# EAGLE design leakio (EAGLE 9.6.2)
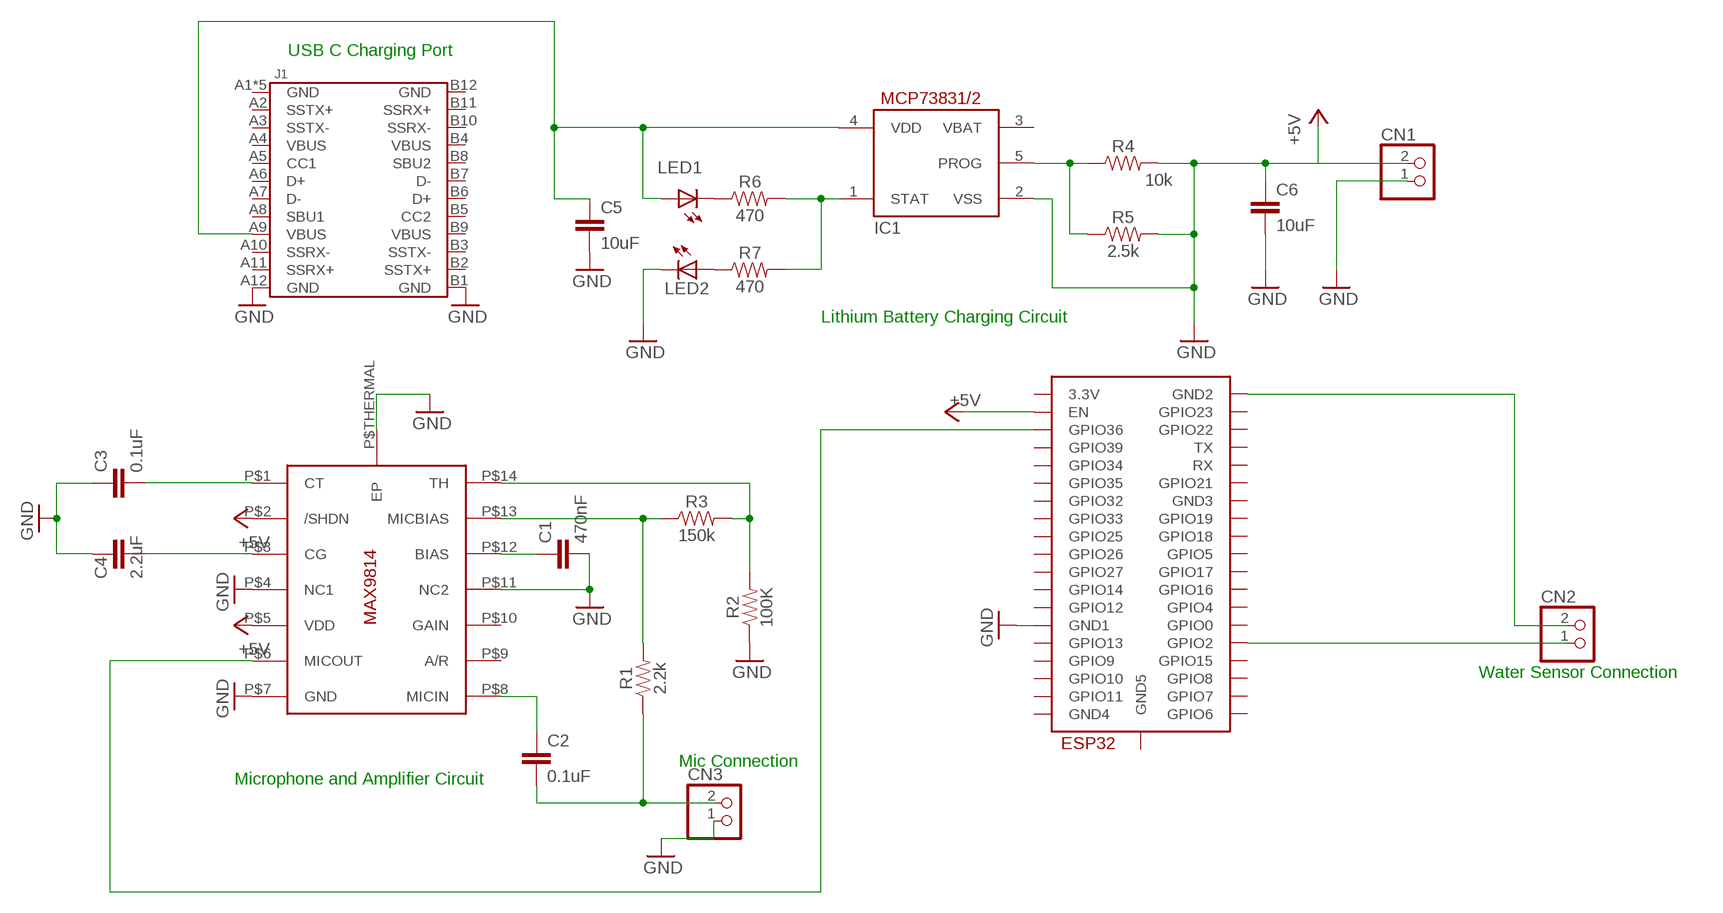
[diagram p0: schematic, sheet 1]

## Parts
C1  470nF  470NF-0402-16V-10%  [0402]
C2  0.1uF  0.1UF-0402-16V-10%  [0402]
C3  0.1uF  0.1UF-0402-16V-10%  [0402]
C4  2.2uF  2.2UF-0603-10V-20%  [0603]
C5  10uF  10UF-0603-6.3V-20%  [0603]
C6  10uF  10UF-0603-6.3V-20%  [0603]
CN1  JST_2PIN-SMT-RA  [JST-PH-2-SMT-RA]
CN2  JST_2PIN-SMT  [JST-PH-2-SMT]
CN3  JST_2PIN-SMT  [JST-PH-2-SMT]
IC1  MCP73831/OT  [SOT23-5L]
J1  USBC-PTH  [USB-C-PTH]
LED1  LED  [SMARTLED-TTW]
LED2  LED  [SMARTLED-TTW]
R1  2.2k  2.2KOHM-0603-1/10W-1%  [0603]
R2  100K  100KOHM-0402-1/16W-1%  [0402]
R3  150k  150KOHM-0603-1/10W-1%  [0603]
R4  10k  10KOHM-0603-1/10W-1%  [0603]
R5  2.5k  10KOHM-0603-1/10W-1%  [0603]
R6  470  10KOHM-0603-1/10W-1%  [0603]
R7  470  10KOHM-0603-1/10W-1%  [0603]
U$1  ESP32-WROOM  [ESP32-WROOM]
U$2  MAX9814TDFN14  [TDFN14_3X3MM]

## Nets
+5V: C6.1 CN1.2 IC1.2(VSS) R4.2 R5.2 U$1.EN U$2.P$2(/SHDN) U$2.P$5(VDD) ; supply symbol labelled GND
GND: C1.2 C3.1 C4.1 C5.2 C6.2 CN3.1 J1.A12(GND) J1.B1(GND) LED2.C@1(C) R2.1 U$1.GND1 U$2.P$4(NC1) U$2.P$7(GND) U$2.P$11(NC2) U$2.P$THERMAL(EP)
N$1: C3.2 U$2.P$1(CT)
N$2: C4.2 U$2.P$3(CG)
N$3: C5.1 IC1.4(VDD) J1.A9(VBUS) LED1.A@1(A)
N$4: U$1.SENSOR_VP(GPIO36) U$2.P$6(MICOUT)
N$5: C2.1 U$2.P$8(MICIN)
N$6: C2.2 CN3.2 R1.1
N$7: C1.1 U$2.P$12(BIAS)
N$8: LED2.A@1(A) R7.1
N$9: R1.2 R3.1 U$2.P$13(MICBIAS)
N$10: R2.2 R3.2 U$2.P$14(TH)
N$11: IC1.5(PROG) R4.1 R5.1
N$12: LED1.C@1(C) R6.1
N$13: CN2.1 U$1.IO2(GPIO2)
N$14: CN1.1 ; supply symbol labelled GND
N$15: CN2.2 U$1.GND2
N$16: IC1.1(STAT) R6.2 R7.2
Unconnected: IC1.3(VBAT) J1.A1(GND) J1.A2(SSTX+) J1.A3(SSTX-) J1.A4(VBUS) J1.A5(CC1) J1.A6(D+) J1.A7(D-) J1.A8(SBU1) J1.A10(SSRX-) J1.A11(SSRX+) J1.B2(SSTX+) J1.B3(SSTX-) J1.B4(VBUS) J1.B5(CC2) J1.B6(D+) J1.B7(D-) J1.B8(SBU2) J1.B9(VBUS) J1.B10(SSRX-) J1.B11(SSRX+) J1.B12(GND) J1.P$13(GND) J1.P$14(GND) J1.P$15(GND) J1.P$16(GND) U$1.3V3(3.3V) U$1.CLK(GPIO6) U$1.CMD(GPIO11) U$1.GND3 U$1.GND4 U$1.GND5 U$1.IO0(GPIO0) U$1.IO4(GPIO4) U$1.IO5(GPIO5) U$1.IO12(GPIO12) U$1.IO13(GPIO13) U$1.IO14(GPIO14) U$1.IO15(GPIO15) U$1.IO16(GPIO16) U$1.IO17(GPIO17) U$1.IO18(GPIO18) U$1.IO19(GPIO19) U$1.IO21(GPIO21) U$1.IO22(GPIO22) U$1.IO23(GPIO23) U$1.IO25(GPIO25) U$1.IO26(GPIO26) U$1.IO27(GPIO27) U$1.IO32(GPIO32) U$1.IO33(GPIO33) U$1.IO34(GPIO34) U$1.IO35(GPIO35) U$1.RX U$1.SD0(GPIO7) U$1.SD1(GPIO8) U$1.SD2(GPIO9) U$1.SD3(GPIO10) U$1.SENSOR_VN(GPIO39) U$1.TX U$2.P$9(A/R) U$2.P$10(GAIN)

## Notes on the sheet
- USB C Charging Port
- Lithium Battery Charging Circuit
- Water Sensor Connection
- Mic Connection
- Microphone and Amplifier Circuit

## Library data of the parts
C1 = SparkFun-Capacitors:470NF: 0.47uF/470nF ceramic capacitors A capacitor is a passive two-terminal electrical component used to store electrical energy temporarily in an electric field.; PROD_ID: CAP-09041
C2 C3 = SparkFun-Capacitors:0.1UF: 0.1µF ceramic capacitors A capacitor is a passive two-terminal electrical component used to store electrical energy temporarily in an electric field.; PROD_ID: CAP-12416
C4 = SparkFun-Capacitors:2.2UF: 2.2µF ceramic capacitors A capacitor is a passive two-terminal electrical component used to store electrical energy temporarily in an electric field.; PROD_ID: CAP-07888
C5 C6 = SparkFun-Capacitors:10UF: 10.0µF ceramic capacitors A capacitor is a passive two-terminal electrical component used to store electrical energy temporarily in an electric field.; PROD_ID: CAP-11015
CN1-CN3 = adafruit:JST_2PIN: JST 2-Pin Connectors of various flavors SMT-RA (S2B-PH-SM4) 4UConnector #17311 SMT (B2B-PH-SM4) THM-RA (S2B-PH) THM (B2B-PH)
IC1 = adafruit:MCP73831: MCP73831/2 Miniature Single-Cell, Fully Integrated Li-Ion, Li-Polymer Charge Management Controllers. Nice and small simple lipoly charge controller, with adjustable current and status output (LED) http://www.ladyada.net/library/pcb/eaglelibrary.html
J1 = Connectors:USBC
LED1 LED2 = adafruit:LED: LED OSRAM: - CHIPLED LG R971, LG N971, LY N971, LG Q971, LY Q971, LO R971, LY R971 LH N974, LH R974 LS Q976, LO Q976, LY Q976 LO Q996 - Hyper CHIPLED LW Q18S LB Q993, LB Q99A, LB R99A - SideLED LS A670, LO A670, LY A670, LG A670, LP A670 LB A673, LV A673, LT A673, LW A673 LH A674 LY A675 LS A676, LA A676, LO A676, LY A676, LW A676 LS A679, LY A679, LG A679 - Hyper Micro SIDELED® LS Y876, LA Y876, LO Y876, LY Y876 LT Y87S - SmartLED LW L88C, LW L88S LB L89C, LB L89S, LG L890 LS L89K, LO L89K, LY L89K LS L896, LA L896, LO L896, LY L896 - TOPLED LS T670, LO T670, LY T670, LG T670, LP T670 LSG T670, LSP T670, LSY T670, LOP T670, LYG T670 LG T671, LOG T671, LSG T671 LB T673, LV T673, LT T673, LW T673 LH T674 LS T676, LA T676, LO T676, LY T676, LB T676, LH T676, LSB T676, LW T676 LB T67C, LV T67C, LT T67C, LS T67K, LO T67K, LY T67K, LW E67C LS E67B, LA E67B, LO E67B, LY E67B, LB E67C, LV E67C, LT E67C LW T67C LS T679, LY T679, LG T679 LS T770, LO T770, LY T770, LG T770, LP T770 LB T773, LV T773, LT T773, LW T773 LH T774 LS E675, LA E675, LY E675, LS T675 LS T776, LA T776, LO T776, LY T776, LB T776 LHGB T686 LT T68C, LB T68C - Hyper Mini TOPLED® LB M676 - Mini TOPLED Santana® LG M470 LS M47K, LO M47K, LY M47K Source: http://www.osram.convergy.de/
R1 = SparkFun-Resistors:2.2KOHM: 2.2kΩ resistor A resistor is a passive two-terminal electrical component that implements electrical resistance as a circuit element. Resistors act to reduce current flow, and, at the same time, act to lower voltage levels within circuits. - Wikipedia; PROD_ID: RES-08272
R2 = SparkFun-Resistors:100KOHM: 100kΩ resistor A resistor is a passive two-terminal electrical component that implements electrical resistance as a circuit element. Resistors act to reduce current flow, and, at the same time, act to lower voltage levels within circuits. - Wikipedia; PROD_ID: RES-13495
R3 = SparkFun-Resistors:150KOHM: 150kΩ resistor A resistor is a passive two-terminal electrical component that implements electrical resistance as a circuit element. Resistors act to reduce current flow, and, at the same time, act to lower voltage levels within circuits. - Wikipedia; PROD_ID: RES-09117
R4 = SparkFun-Resistors:10KOHM: 10kΩ resistor A resistor is a passive two-terminal electrical component that implements electrical resistance as a circuit element. Resistors act to reduce current flow, and, at the same time, act to lower voltage levels within circuits. - Wikipedia; PROD_ID: RES-00824
R5-R7 = SparkFun-Resistors:10KOHM: 10kΩ resistor A resistor is a passive two-terminal electrical component that implements electrical resistance as a circuit element. Resistors act to reduce current flow, and, at the same time, act to lower voltage levels within circuits. - Wikipedia; PROD_ID: RES-00824; VALUE: 10k
U$1 = ESP32:ESP32-WROOM
U$2 = adafruit:MAX9814

## Board
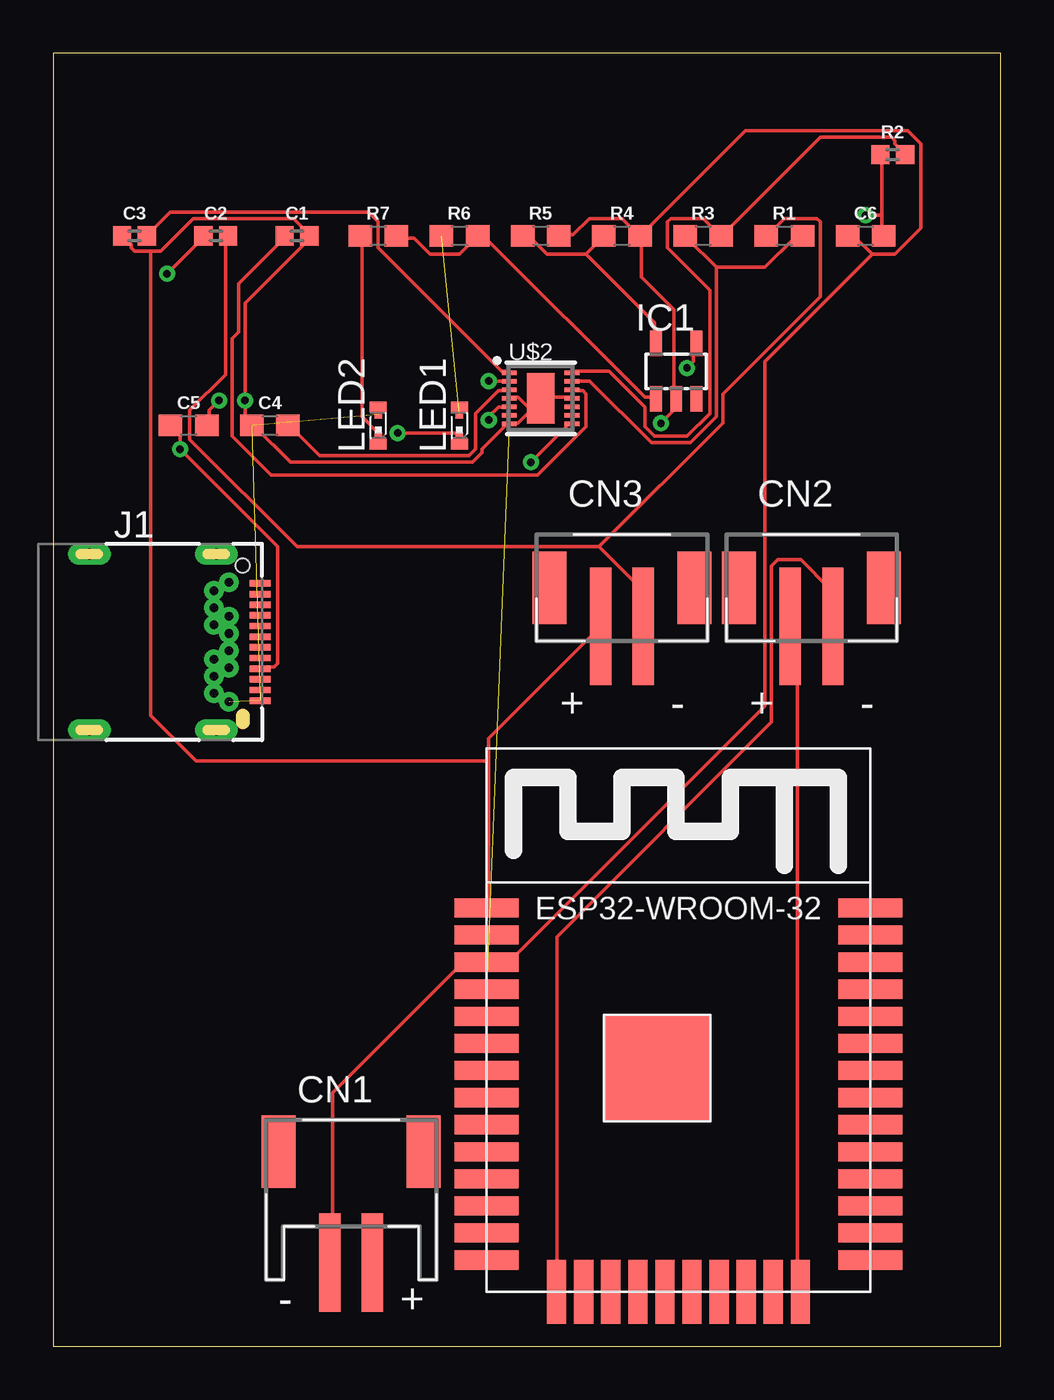
[diagram p1: board, top side]
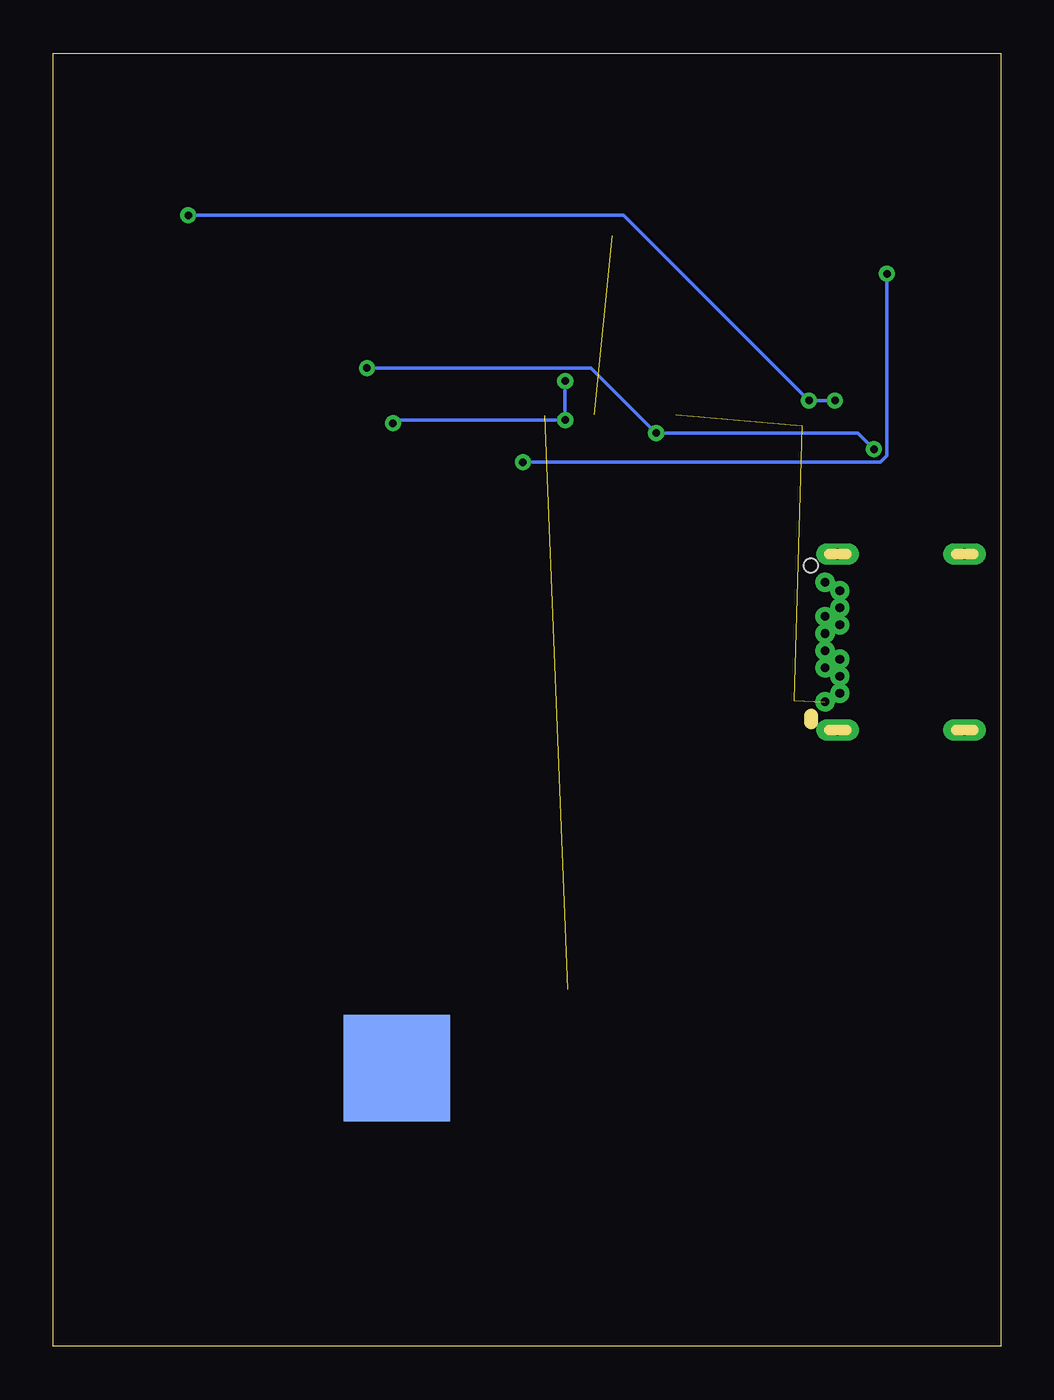
[diagram p2: board, bottom side, seen from below]

Size 44.43 x 60.63 mm. Coordinates in mm from the lower left corner, seen from the top.
Outline: 0,0 44.43,0 44.43,60.63 0,60.63 0,0
Copper layers (1*16): Top 0.035mm / dielectric 1.5mm / Bottom 0.035mm
Design rules "default": minimum track width 6mil, minimum drill 0.35mm, track to track 6mil, track to pad 6mil, pad to pad 6mil, via to via 6mil, smd to smd 6mil, copper to edge 40mil, drill to drill 6mil, minimum pad ring 10mil, minimum via ring 8mil, stop-mask expansion 4mil, vias tented up to drill 0mil, thermal gap 10mil

### Footprints (pad centres in the part's own frame; a part is rotated, then mirrored left to right if it is on the bottom)
0402 = smd 0.85 x 0.9: 1 -0.58,0; 2 0.58,0
0603 = smd 1.1 x 1: 1 -0.85,0; 2 0.85,0
JST-PH-2-SMT-RA = smd 1 x 4.6: 1 1,-3.7; 2 -1,-3.7 | smd 1.6 x 3.4: NC1 -3.4,1.5; NC2 3.4,1.5
JST-PH-2-SMT = smd 1 x 5.5: 1 -1,-1.8; 2 1,-1.8 | smd 1.6 x 3.4: NC1 -3.4,0; NC2 3.4,0
SOT23-5L = smd 0.55 x 1.2: 1 -0.95,-1.3; 2 0,-1.3; 3 0.95,-1.3; 4 0.95,1.3; 5 -0.95,1.3
USB-C-PTH = smd 1 x 0.3: A1 0.81,2.75; A2 0.81,2.25; A3 0.81,1.75; A4 0.81,1.25; A5 0.81,0.75; A6 0.81,0.25; A7 0.81,-0.25; A8 0.81,-0.75; A9 0.81,-1.25; A10 0.81,-1.75; A11 0.81,-2.25; A12 0.81,-2.75 | drill 0.4 pad 0.65: B1 -0.65,-2.8; B2 -1.35,-2.4; B3 -1.35,-1.6; B4 -0.65,-1.2; B5 -1.35,-0.8; B6 -0.65,-0.4; B7 -0.65,0.4; B8 -1.35,0.8; B9 -0.65,1.2; B10 -1.35,1.6; B11 -1.35,2.4; B12 -0.65,2.8 | drill 0.5 pad 0.8 long: P$13 -1.25,4.13; P$14 -1.25,-4.13; P$15 -7.2,4.13; P$16 -7.2,-4.13 | hole 0.65: 0,3.6
SMARTLED-TTW = smd 0.8 x 0.5: A 0,-0.875; C 0,0.875 | smd 0.35 x 0.35: A@1 0,-0.5; C@1 0,0.5
ESP32-WROOM = smd 3 x 0.9: 3V3 0,16.74; EN 0,15.47; GND1 0,18.01; GND3 18,18.01; IO0 18,1.5; IO4 18,2.77; IO5 18,6.58; IO12 0,1.5; IO14 0,2.77; IO16 18,4.04; IO17 18,5.31; IO18 18,7.85; IO19 18,9.12; IO21 18,11.66; IO22 18,15.47; IO23 18,16.74; IO25 0,6.58; IO26 0,5.31; IO27 0,4.04; IO32 0,9.12; IO33 0,7.85; IO34 0,11.66; IO35 0,10.39; NC 18,10.39; RX 18,12.93; SENSOR_VN 0,12.93; SENSOR_VP 0,14.2; TX 18,14.2 | smd 0.9 x 3: CLK 9.635,0; CMD 8.365,0; GND2 3.285,0; IO2 14.715,0; IO13 4.555,0; IO15 13.445,0; SD0 10.905,0; SD1 12.175,0; SD2 5.825,0; SD3 7.095,0 | smd 5 x 5: GND4 8,10.5 | smd 5 x 5 bottom: GND5 8,10.5
TDFN14_3X3MM = smd 0.7 x 0.2: P$1 -1.475,1.2; P$2 -1.475,0.8; P$3 -1.475,0.4; P$4 -1.475,0; P$5 -1.475,-0.4; P$6 -1.475,-0.8; P$7 -1.475,-1.2; P$8 1.475,-1.2; P$9 1.475,-0.8; P$10 1.475,-0.4; P$11 1.475,0; P$12 1.475,0.4; P$13 1.475,0.8; P$14 1.475,1.2 | smd 1.27 x 2.35: P$THERMAL 0,0

### Placement (x,y rotation side)
C1  11.43,52.07 0 top
C2  7.62,52.07 0 top
C3  3.81,52.07 0 top
C4  10.16,43.18 0 top
C5  6.35,43.18 0 top
C6  38.1,52.07 0 top
CN1  13.97,7.62 0 top
CN2  35.56,35.56 0 top
CN3  26.67,35.56 0 top
IC1  29.21,45.72 0 top
J1  8.89,33.02 0 top
LED1  19.05,43.18 0 top
LED2  15.24,43.18 0 top
R1  34.29,52.07 0 top
R2  39.37,55.88 0 top
R3  30.48,52.07 0 top
R4  26.67,52.07 0 top
R5  22.86,52.07 0 top
R6  19.05,52.07 0 top
R7  15.24,52.07 0 top
U$1  20.32,2.54 0 top
U$2  22.86,44.45 0 top

### Tracks (layer width: path | path; a pad name or v marks a point on that pad's centre or on a via)
+5V  (via drill 0.35)
  Top 0.152: CN1.2 13.11,3.96 13.11,11.89 19.2,17.98 20.27,17.98 U$1.EN 20.42,18.14 21.49,18.14 33.38,30.02 33.38,46.18 38.41,51.21 | v20.42,43.43 20.42,43.59 20.88,44.04 21.34,44.04 U$2.P$5 | v20.42,45.26 21.34,45.26 U$2.P$2 | R5.2 23.77,52.12 24.38,52.12 25.15,52.88 26.67,52.88 27.43,52.12 R4.2 | 38.41,51.21 37.64,51.97 37.34,51.97 C6.1 | 38.41,51.21 39.47,51.21 40.69,52.43 40.69,56.39 40.08,57 32.46,57 27.58,52.12 R4.2 | R4.2 27.58,51.97 27.58,50.14 29.11,48.62 29.11,44.5 IC1.2 29.11,44.35 29.11,43.89 v28.5,43.28
  Bottom 0.152: v20.42,45.26 v20.42,43.43 28.35,43.43 v28.5,43.28
GND  (via drill 0.35)  (3 unrouted)
  Top 0.152: 20.42,27.43 20.42,28.5 25.6,33.68 CN3.1 | 20.42,27.43 20.42,20.57 U$1.GND1 | 22.4,43.89 22.86,44.35 U$2.P$THERMAL | 22.4,43.89 21.79,43.28 21.49,43.28 U$2.P$7 21.34,43.28 20.12,42.06 20.12,41.91 19.66,41.45 11.12,41.45 9.45,43.13 C4.1 9.3,43.28 8.99,43.59 v8.99,44.35 8.99,48.92 12.04,51.97 C1.2 12.04,52.12 11.28,52.88 6.55,52.88 5.03,51.36 4.57,51.36 | 22.4,43.89 21.79,44.5 21.49,44.5 U$2.P$4 | 22.4,43.89 U$2.P$THERMAL | U$2.P$11 24.23,44.5 22.86,44.5 U$2.P$THERMAL | 38.86,53.03 38.86,52.12 C6.2 | 38.86,53.03 38.86,55.78 R2.1 | v7.77,44.35 7.32,43.89 7.32,43.28 C5.2 | 4.57,51.36 3.81,51.36 3.66,51.51 3.66,51.66 3.35,51.97 C3.1 | v38.1,53.03 38.86,53.03 | 20.42,27.43 6.71,27.43 4.57,29.57 4.57,51.36
  Bottom 0.152: v7.77,44.35 v8.99,44.35 17.68,53.03 v38.1,53.03
N$1
  Top 0.152: U$2.P$1 21.34,45.72 21.03,45.72 15.24,51.51 15.24,52.73 14.78,53.19 5.49,53.19 4.42,52.12 C3.2
N$2
  Top 0.152: U$2.P$3 21.34,44.81 20.88,44.81 19.81,43.74 19.81,42.06 19.51,41.76 12.5,41.76 11.12,43.13 C4.2
N$3  (via drill 0.35)
  Top 0.152: v16.15,42.82 19.05,42.82 LED1.A@1 | C5.1 5.64,43.13 5.94,42.82 v5.94,42.06 10.52,37.49 10.52,32 10.36,31.85 9.75,31.85 J1.A9 | v29.72,45.87 30.02,46.18 30.02,46.94 IC1.4
  Bottom 0.152: v5.94,42.06 6.71,42.82 v16.15,42.82 19.2,45.87 v29.72,45.87
N$4  (1 unrouted)
N$5  (via drill 0.35)
  Top 0.152: v22.4,41.45 24.23,43.28 U$2.P$8 | v5.33,50.29 7.01,51.97 C2.1
  Bottom 0.152: v22.4,41.45 5.64,41.45 5.33,41.76 v5.33,50.29
N$6
  Top 0.152: 25.6,37.49 11.43,37.49 6.4,42.52 6.4,43.89 8.08,45.57 8.08,51.97 C2.2 | 25.6,37.49 27.58,35.51 27.58,33.83 CN3.2 | 25.6,37.49 31.39,43.28 31.39,44.65 35.97,49.23 35.97,52.73 35.81,52.88 34.29,52.88 33.53,52.12 R1.1
N$7
  Top 0.152: U$2.P$12 24.38,44.81 24.84,44.81 24.99,44.65 24.99,43.13 22.71,40.84 10.21,40.84 8.38,42.67 8.38,47.24 8.69,47.55 8.69,49.84 10.82,51.97 C1.1
N$8
  Top 0.152: LED2.A@1 15.24,42.82 14.48,43.59 14.48,51.97 R7.1
N$9
  Top 0.152: 31.09,50.6 31.09,43.59 29.87,42.37 28.04,42.37 25.15,45.26 24.38,45.26 U$2.P$13 | 31.09,50.6 29.72,51.97 R3.1 | 31.09,50.6 33.38,50.6 34.75,51.97 35.05,51.97 R1.2
N$10
  Top 0.152: U$2.P$14 24.38,45.72 26.06,45.72 27.74,44.04 27.74,43.13 28.19,42.67 29.72,42.67 30.79,43.74 30.79,49.53 28.8,51.51 28.8,52.73 28.96,52.88 30.48,52.88 31.24,52.12 R3.2 31.39,52.12 35.97,56.69 39.32,56.69 39.47,56.54 39.47,56.39 39.93,55.93 R2.2
N$11
  Top 0.152: 24.99,51.21 23.17,51.21 22.4,51.97 22.1,51.97 R5.1 | 24.99,51.21 25.76,51.97 R4.1 | 24.99,51.21 28.19,48.01 28.19,47.09 IC1.5
N$12  (1 unrouted)
N$13
  Top 0.152: U$1.IO2 34.9,2.59 34.9,33.38 34.59,33.68 CN2.1
N$15
  Top 0.152: U$1.GND2 23.62,2.59 23.62,19.2 33.68,29.26 33.68,36.58 33.98,36.88 35.05,36.88 36.42,35.51 36.42,33.83 CN2.2
N$16
  Top 0.152: R7.2 16.15,51.97 16.92,51.97 17.68,51.21 19.05,51.21 19.81,51.97 R6.2 19.96,51.97 20.27,51.97 27.74,44.5 28.19,44.5 IC1.1